# Altium schematic sheet RTU_LMG_DI.SchDoc
size A3; SheetNumber: 15; SheetTotal: 16
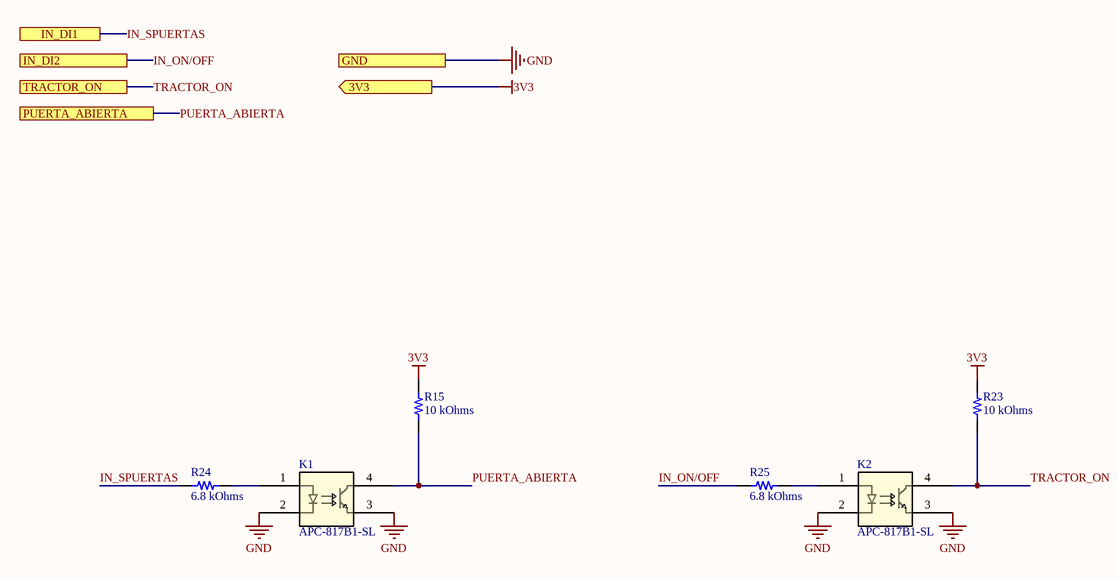
[diagram p0: RTU_LMG_DI.SchDoc]

## Parts
K1  APC-817B1-SL  [APC-817xx-SL_AMB]
K2  APC-817B1-SL  [APC-817xx-SL_AMB]
R15  10 kOhms  [RES 0603_1608]
R23  10 kOhms  [RES 0603_1608]
R24  6.8 kOhms  [RES 0603_1608]
R25  6.8 kOhms  [RES 0603_1608]

## Ports
3V3 (out), GND, IN_DI1, IN_DI2, PUERTA_ABIERTA, TRACTOR_ON

## Nets
3V3: R15.2 R23.2 ; port 3V3
GND: K1.2 K1.3 K2.2 K2.3 ; port GND
IN_ON/OFF: R25.1 ; port IN_DI2
IN_SPUERTAS: R24.1 ; port IN_DI1
PUERTA_ABIERTA: K1.4 R15.1 ; port PUERTA_ABIERTA
TRACTOR_ON: K2.4 R23.1 ; port TRACTOR_ON
NetK1_1: K1.1 R24.2
NetK2_1: K2.1 R25.2

## Library data of the parts
K1 K2 = APC-817B1-SL: Description; Manufacturer_Name: American Bright; Type: Optoisolators; Copyright: Copyright (C) 2025 Ultra Librarian. All rights reserved.; Manufacturer_Part_Number: APC-817B1-SL; RefDes: RefDes
R15 R23 = RC0603FR-0710KL: RES 10K OHM 1% 1/10W 0603; Manufacturer: Yageo; Power (Watts): 0.1W, 1/10W; Temperature Coefficient: ±100ppm/°C; Part Number: RC0603FR-0710KL; Value: 10 kOhms; ComponentLink1Description: Datasheet; ComponentLink1URL: https://www.yageo.com/upload/media/product/productsearch/datasheet/rchip/PYu-RC_Group_51_RoHS_L_10.pdf; ComponentLink2Description: DigiKey Link; ComponentLink2URL: https://www.digikey.com/en/products/detail/yageo/RC0603FR-0710KL/726880; Composition: Thick Film; Device Package: 0603 (1608 Metric); Features: Moisture Resistant; Height - Seated (Max): 0.022" (0.55mm); LastUpdated: 10/30/2023 7:36:43 PM; Lifecycle Status: Active; Minimum Order: 1; Number of Terminations: 2; Operating Temperature: -55°C ~ 155°C; Package / Case: 0603 (1608 Metric); Packaging: CutTape; PartId: 22599; Part Status: Active; Price: 0.01; Resistance: 10 kOhms; Series: RC_L; Size / Dimension: 0.063" L x 0.031" W (1.60mm x 0.80mm); Supplier 1: DigiKey; Supplier Part Number 1: 311-10.0KHRCT-ND; Supplier Device Package: 0603; Tolerance: ±1%
R24 R25 = RMCF0603JT6K80: RES 6.8K OHM 5% 1/10W 0603; Manufacturer: Stackpole Electronics Inc; Power (Watts): 0.1W, 1/10W; Temperature Coefficient: ±200ppm/°C; Part Number: RMCF0603JT6K80; Value: 6.8 kOhms; ComponentLink1Description: Datasheet; ComponentLink1URL: https://www.seielect.com/catalog/sei-rmcf_rmcp.pdf; ComponentLink2Description: DigiKey Link; ComponentLink2URL: https://www.digikey.com/en/products/detail/stackpole-electronics-inc/RMCF0603JT6K80/1757963; Composition: Thick Film; Device Package: 0603 (1608 Metric); Features: Automotive AEC-Q200; Height - Seated (Max): 0.022" (0.55mm); LastUpdated: 9/2/2024 20:43:33; Lifecycle Status: Active; Minimum Order: 1; Number of Terminations: 2; Operating Temperature: -55°C ~ 155°C; Package / Case: 0603 (1608 Metric); Packaging: CutTape; PartId: 5918; Part Status: Active; Price: 0.01; Ratings: AEC-Q200; Resistance: 6.8 kOhms; Series: RMCF; Size / Dimension: 0.061" L x 0.031" W (1.55mm x 0.80mm); Supplier 1: DigiKey; Supplier Part Number 1: RMCF0603JT6K80CT-ND; Supplier Device Package: 0603; Tolerance: ±5%